# EAGLE design 0113-phobos (EAGLE 9.5.2)
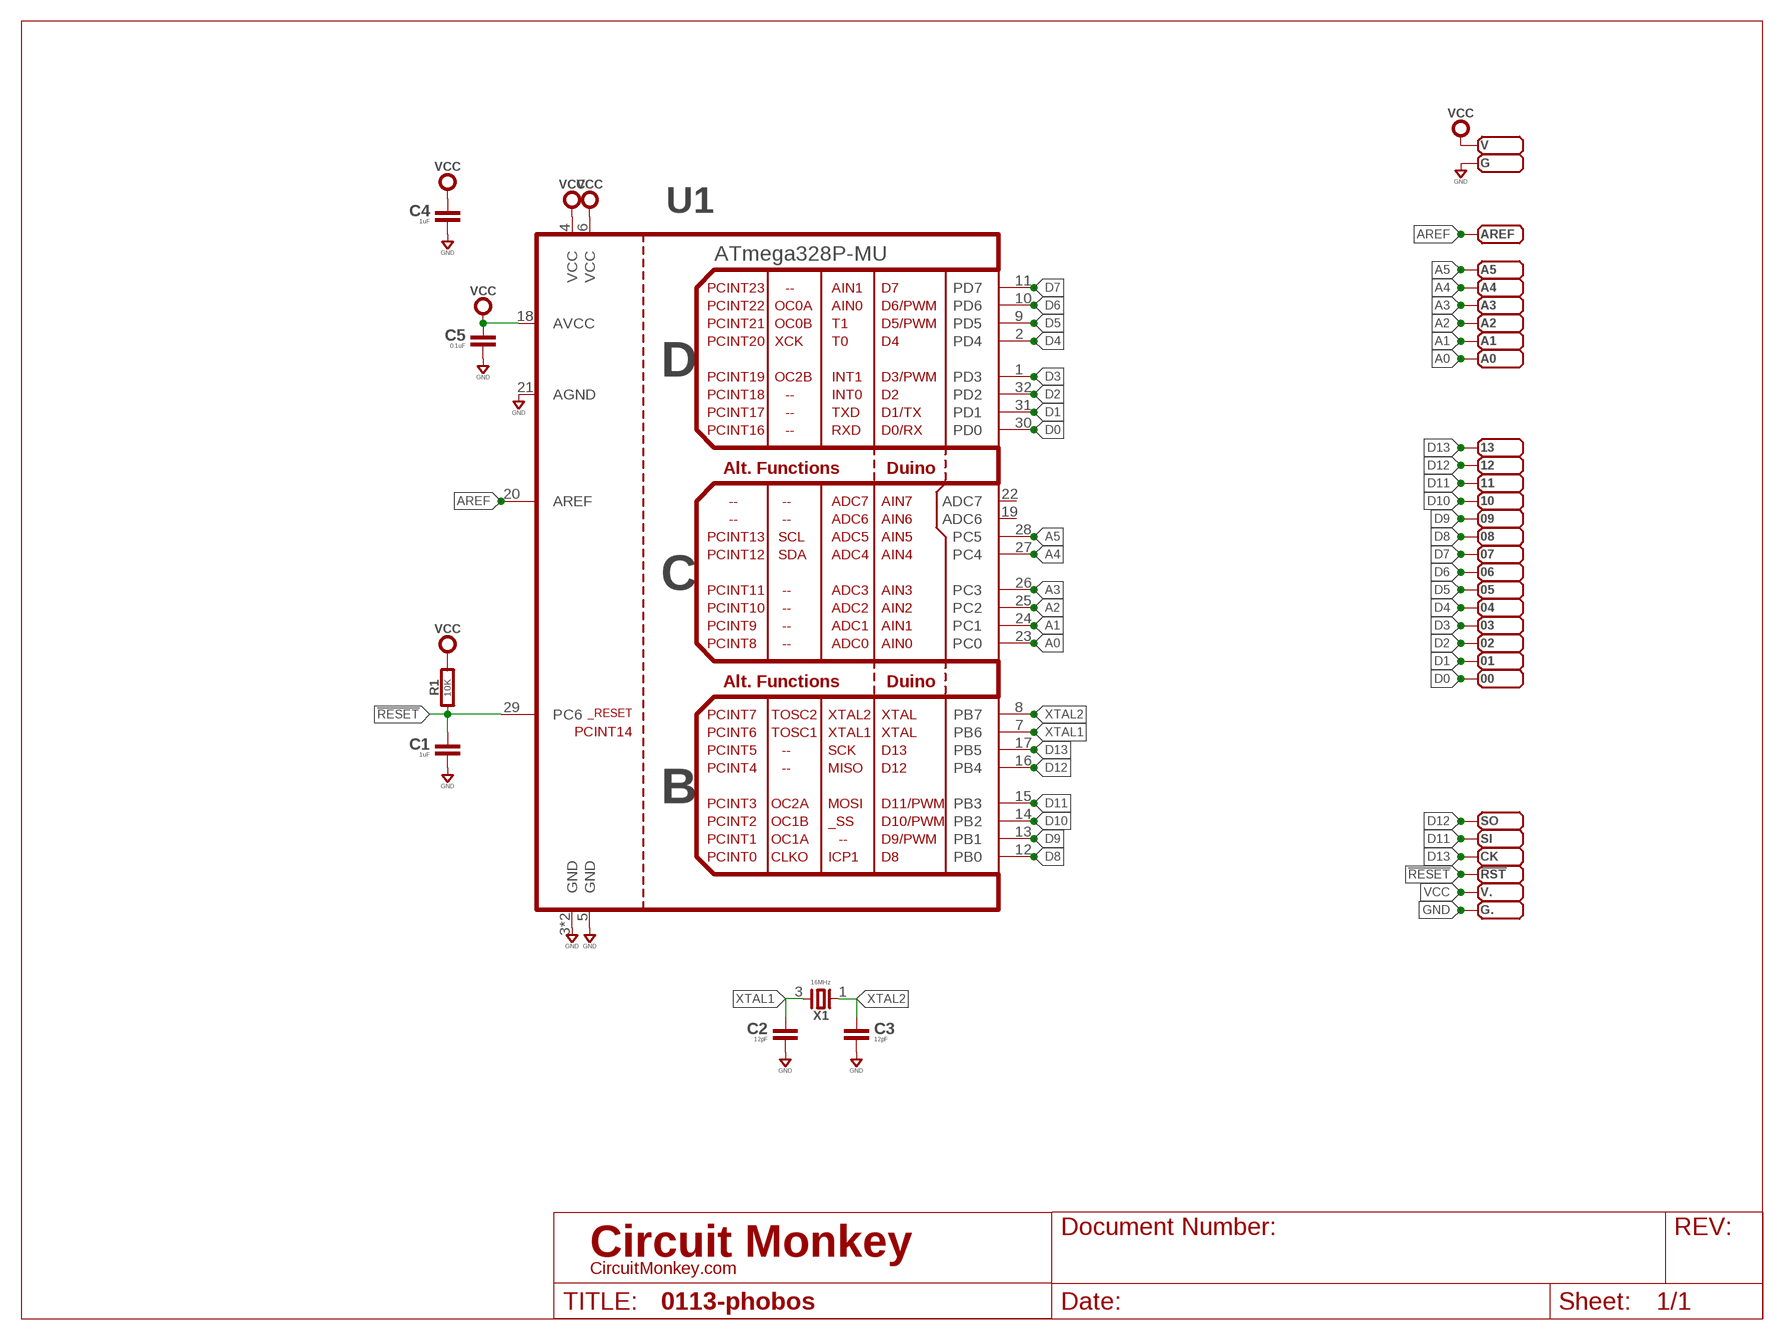
[diagram p0: schematic, sheet 1]

## Parts
00  PADSMD-070X070  [SMD-070MIL]
01  PADSMD-070X070  [SMD-070MIL]
02  PADSMD-070X070  [SMD-070MIL]
03  PADSMD-070X070  [SMD-070MIL]
04  PADSMD-070X070  [SMD-070MIL]
05  PADSMD-070X070  [SMD-070MIL]
06  PADSMD-070X070  [SMD-070MIL]
07  PADSMD-070X070  [SMD-070MIL]
08  PADSMD-070X070  [SMD-070MIL]
09  PADSMD-070X070  [SMD-070MIL]
10  PADSMD-070X070  [SMD-070MIL]
11  PADSMD-070X070  [SMD-070MIL]
12  PADSMD-070X070  [SMD-070MIL]
13  PADSMD-070X070  [SMD-070MIL]
!RST  PADSMD-070X070  [SMD-070MIL]
A0  PADSMD-070X070  [SMD-070MIL]
A1  PADSMD-070X070  [SMD-070MIL]
A2  PADSMD-070X070  [SMD-070MIL]
A3  PADSMD-070X070  [SMD-070MIL]
A4  PADSMD-070X070  [SMD-070MIL]
A5  PADSMD-070X070  [SMD-070MIL]
AREF  PADSMD-070X070  [SMD-070MIL]
C1  1uF  CAPACITOR0402  [0402-CAP]
C2  12pF  CAPACITOR0402  [0402-CAP]
C3  12pF  CAPACITOR0402  [0402-CAP]
C4  1uF  CAPACITOR0402  [0402-CAP]
C5  0.1uF  CAPACITOR0402  [0402-CAP]
CK  PADSMD-070X070  [SMD-070MIL]
G  PADSMD-070X070  [SMD-070MIL]
G.  PADSMD-070X070  [SMD-070MIL]
R1  10K  RESISTOR0402  [0402-RES]
SI  PADSMD-070X070  [SMD-070MIL]
SO  PADSMD-070X070  [SMD-070MIL]
U1  ATmega328P-MU  ATMEGA328MU  [MLF32]
V  PADSMD-070X070  [SMD-070MIL]
V.  PADSMD-070X070  [SMD-070MIL]
X1  16MHz  2P3.2X2.5  [32X25]

## Nets
!RESET: !RST.1(PAD) C1.1 R1.1 U1.29(PC6)
A0: A0.1(PAD) U1.23(PC0)
A1: A1.1(PAD) U1.24(PC1)
A2: A2.1(PAD) U1.25(PC2)
A3: A3.1(PAD) U1.26(PC3)
A4: A4.1(PAD) U1.27(PC4)
A5: A5.1(PAD) U1.28(PC5)
AREF: AREF.1(PAD) U1.20(AREF)
D0: 00.1(PAD) U1.30(PD0)
D1: 01.1(PAD) U1.31(PD1)
D2: 02.1(PAD) U1.32(PD2)
D3: 03.1(PAD) U1.1(PD3)
D4: 04.1(PAD) U1.2(PD4)
D5: 05.1(PAD) U1.9(PD5)
D6: 06.1(PAD) U1.10(PD6)
D7: 07.1(PAD) U1.11(PD7)
D8: 08.1(PAD) U1.12(PB0)
D9: 09.1(PAD) U1.13(PB1)
D10: 10.1(PAD) U1.14(PB2)
D11: 11.1(PAD) SI.1(PAD) U1.15(PB3)
D12: 12.1(PAD) SO.1(PAD) U1.16(PB4)
D13: 13.1(PAD) CK.1(PAD) U1.17(PB5)
GND: C1.2 C2.2 C3.2 C4.2 C5.2 G.1(PAD) G..1(PAD) U1.3(GND) U1.5(GND) U1.21(AGND) U1.PAD(GND)
VCC: C4.1 C5.1 R1.2 U1.4(VCC) U1.6(VCC) U1.18(AVCC) V.1(PAD) V..1(PAD)
XTAL1: C2.1 U1.7(PB6) X1.3
XTAL2: C3.1 U1.8(PB7) X1.1
Unconnected: U1.19(ADC6) U1.22(ADC7)

## Library data of the parts
00 01-09 10-13 !RST A0 A1-A5 AREF CK G G. SI SO V V. = con-testpoints:PAD: Solder Pad
C1-C5 = rlc:CAPACITOR: Capacitor CAP
R1 = rlc:RESISTOR: Resistor
U1 = atmel-atmega:ATMEGA328: Atmega 328P; MF: Atmel; MPN: atmega328p-mu; OC_MOUSER: 556-ATMEGA328P-MU; OC_SEEED: 310010005
X1 = xtal:2P: Crystal; MF: Epson; MPN: FA-238 16.0000MB-K3

## Board
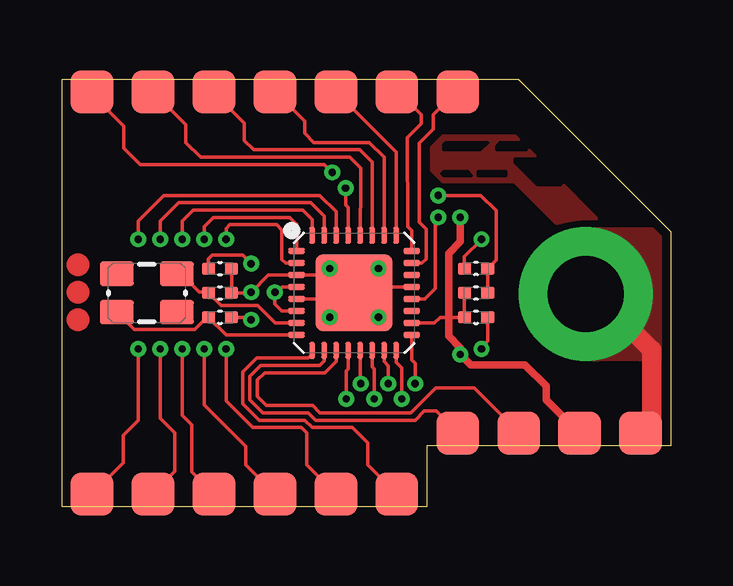
[diagram p1: board, top side]
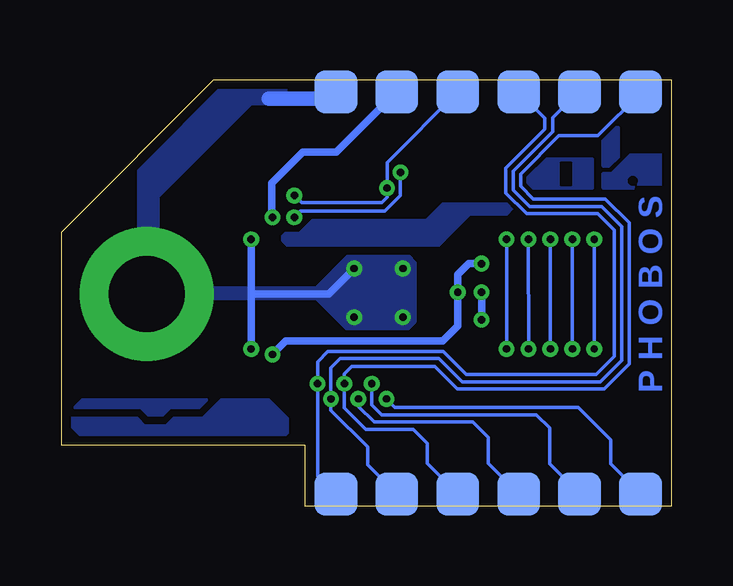
[diagram p2: board, bottom side, seen from below]

Size 25.4 x 17.78 mm. Coordinates in mm from the lower left corner, seen from the top.
Outline: 0,0 15.24,0 15.24,2.54 25.4,2.54 25.4,11.43 19.05,17.78 0,17.78 0,0
Copper layers (1*16): Top 0.0356mm / dielectric 1.5011mm / Bottom 0.0356mm
Design rules "OSH-CircuitMonkey *": minimum track width 6mil, minimum drill 12mil, track to track 6mil, track to pad 6mil, pad to pad 6mil, via to via 6mil, smd to smd 6mil, copper to edge 15mil, drill to drill 6mil, minimum pad ring 7mil, minimum via ring 7mil, stop-mask expansion 3mil, vias tented up to drill 12mil, thermal gap 10mil
tRestrict: area 15.9,14.9 to 17.8,15.2; area 18.9,13.4 to 20.8,14.5; area 15.8,13.8 to 17.1,13.9; area 17.4,13.8 to 18.5,13.9; area 18.1,14.9 to 19.4,15.2
bRestrict: area 1.4,13.4 to 1.8,13.8; area 4.2,13.4 to 4.6,14.3

### Footprints (pad centres in the part's own frame; a part is rotated, then mirrored left to right if it is on the bottom)
SMD-070MIL = smd 1.778 x 1.778: 1 0.508,0
0402-CAP = smd 0.559 x 0.508: 1 -0.483,0; 2 0.483,0
0402-RES = smd 0.559 x 0.508: 1 -0.483,0; 2 0.483,0
MLF32 = smd 0.7 x 0.25: 1 -2.4,1.75; 2 -2.4,1.25; 3 -2.4,0.75; 4 -2.4,0.25; 5 -2.4,-0.25; 6 -2.4,-0.75; 7 -2.4,-1.25; 8 -2.4,-1.75; 17 2.4,-1.75; 18 2.4,-1.25; 19 2.4,-0.75; 20 2.4,-0.25; 21 2.4,0.25; 22 2.4,0.75; 23 2.4,1.25; 24 2.4,1.75 | smd 0.25 x 0.7: 9 -1.75,-2.4; 10 -1.25,-2.4; 11 -0.75,-2.4; 12 -0.25,-2.4; 13 0.25,-2.4; 14 0.75,-2.4; 15 1.25,-2.4; 16 1.75,-2.4; 25 1.75,2.4; 26 1.25,2.4; 27 0.75,2.4; 28 0.25,2.4; 29 -0.25,2.4; 30 -0.75,2.4; 31 -1.25,2.4; 32 -1.75,2.4 | smd 3.2 x 3.2: PAD 0,0
32X25 = smd 1.4 x 1: 1 -1.25,-0.8; 2 1.25,-0.8; 3 1.25,0.8; 4 -1.25,0.8

### Placement (x,y rotation side)
00  1.27,0 90 top
01  3.81,0 90 top
02  6.35,0 90 top
03  8.89,0 90 top
04  11.43,0 90 top
05  13.97,0 90 top
06  16.51,2.54 90 top
07  19.05,2.54 90 top
08  1.27,0 90 bottom
09  3.81,0 90 bottom
10  6.35,0 90 bottom
11  8.89,0 90 bottom
12  11.43,0 90 bottom
13  13.97,0 90 bottom
!RST  8.89,17.78 270 bottom
A0  16.51,17.78 270 top
A1  13.97,17.78 270 top
A2  11.43,17.78 270 top
A3  8.89,17.78 270 top
A4  6.35,17.78 270 top
A5  3.81,17.78 270 top
AREF  1.27,17.78 270 top
C1  17.27,9.91 180 top
C2  6.6,8.89 0 top
C3  6.6,7.87 0 top
C4  6.6,9.91 0 top
C5  17.27,7.87 0 top
CK  6.35,17.78 270 bottom
G  24.13,2.54 90 top
G.  13.97,17.78 270 bottom
R1  17.27,8.89 180 top
SI  1.27,17.78 270 bottom
SO  3.81,17.78 270 bottom
U1  12.19,8.89 0 top
V  21.59,2.54 90 top
V.  11.43,17.78 270 bottom
X1  3.56,8.89 0 top

### Tracks (layer width: path | path; a pad name or v marks a point on that pad's centre or on a via)
!RESET  (via drill 0.3)
  Top 0.152: U1.29 11.94,12.45 11.84,12.55 v11.84,13.26 | R1.1 C1.1 18.11,10.26 18.11,12.32 17.48,12.95 v15.7,12.95
  Bottom 0.152: v15.7,12.95 15.39,12.65 12.06,12.65 11.84,12.88 v11.84,13.26 11.84,14.33 !RST.1
A0
  Top 0.152: U1.23 15.02,10.14 15.19,10.31 15.19,11.56 14.91,11.84 14.91,15.14 15.49,15.72 15.49,16.33 16.43,17.27 A0.1
A1
  Top 0.152: U1.24 14.59,11.49 14.43,11.66 14.4,15.37 14.99,15.95 14.99,16.33 14.05,17.27 A1.1
A2
  Top 0.152: U1.25 13.94,14.76 A2.1
A3
  Top 0.152: U1.26 13.44,14.55 12.83,15.16 10.52,15.16 10.13,15.54 10.13,16.05 8.91,17.27 A3.1
A4
  Top 0.152: U1.27 12.94,14.34 12.42,14.86 8,14.86 7.62,15.24 7.62,15.98 6.35,17.25 A4.1
A5
  Top 0.152: U1.28 12.44,12.41 12.47,12.44 12.47,14.1 12.02,14.55 5.79,14.55 5.18,15.16 5.18,15.9 A5.1
AAA
  pour Bottom: 24.99,3.35 24.99,3.66 22.25,3.66 21.95,3.35 21.03,3.35 20.73,3.66 19.51,3.66 18.75,4.42 16.76,4.42 16,3.66 16,3.05 16.15,2.9 24.54,2.9
AREF  (via drill 0.3)
  Top 0.152: U1.20 15.14,8.64 15.57,9.07 15.57,11.91 v15.7,12.04 | v11.28,13.92 10.95,14.25 3.28,14.25 2.59,14.94 2.59,15.85 1.27,17.17 AREF.1
  Bottom 0.152: v15.7,12.04 15.44,12.29 11.94,12.29 11.28,12.96 v11.28,13.92
BBB
  pour Bottom: 19.66,4.11 19.35,4.42 24.54,4.42 24.84,4.11 22.1,4.11 21.79,3.81 21.18,3.81 20.88,4.11
CCC
  pour Bottom: 5.74,13.26 5.94,13.46 5.94,13.72 5.18,14.48 3.28,14.48 3.28,13.26
D0  (via drill 0.3)
  Top 0.152: v3.2,6.55 3.2,3.58 2.56,2.95 2.56,1.8 00.1 | U1.30 11.44,12.28 10.77,12.95 4.27,12.95 3.2,11.89 v3.2,11.12
  Bottom 0.152: v3.2,11.12 v3.2,6.55
D1  (via drill 0.3)
  Top 0.152: U1.31 10.94,12.09 10.38,12.65 4.88,12.65 4.12,11.89 v4.12,11.12 | 01.1 4.12,0.81 4.12,0.84 4.72,1.45 4.72,3.05 4.12,3.66 v4.12,6.55
  Bottom 0.152: v4.12,11.12 v4.12,6.55
D2  (via drill 0.3)
  Top 0.152: U1.32 10.44,11.95 10.05,12.34 5.49,12.34 5.03,11.89 v5.03,11.12 | v5.03,6.55 5.03,3.79 5.44,3.38 5.44,1.42 02.1
  Bottom 0.152: v5.03,11.12 v5.03,6.55
D3  (via drill 0.3)
  Top 0.152: U1.1 9.79,11.75 9.5,12.04 6.33,12.04 5.94,11.65 v5.94,11.12 | v5.94,6.55 5.94,4.22 7.67,2.49 7.67,1.73 03.1
  Bottom 0.152: v5.94,6.55 5.93,6.56 v5.94,11.12
D4  (via drill 0.3)
  Top 0.152: U1.2 9.34,10.14 9.18,10.29 9.18,11.51 8.96,11.73 7.01,11.73 6.86,11.58 v6.86,11.12 | v6.86,6.55 6.86,4.39 7.98,3.28 9.98,3.28 10.21,3.05 10.21,1.73 04.1
  Bottom 0.152: v6.86,11.12 v6.85,6.56 v6.86,6.55
D5
  Top 0.152: U1.9 10.44,6.34 10.29,6.18 8.13,6.18 7.54,5.6 7.54,4.27 8.23,3.58 10.13,3.58 10.44,3.28 12.12,3.28 12.75,2.64 12.75,1.73 05.1
D6
  Top 0.152: U1.10 10.95,6.06 10.76,5.87 8.31,5.87 7.85,5.41 7.85,4.42 8.38,3.89 10.29,3.89 10.59,3.58 14.73,3.58 15.11,3.96 15.62,3.96 16.51,3.07 06.1
D7
  Top 0.152: U1.11 11.44,6.04 11.3,5.9 10.97,5.56 8.46,5.56 8.15,5.26 8.15,4.57 8.53,4.19 10.46,4.19 10.77,3.89 14.55,3.89 15.6,4.93 17.2,4.93 19.05,3.07 07.1
D8  (via drill 0.3)
  Top 0.152: U1.12 11.94,5.72 11.86,5.64 v11.86,4.47
  Bottom 0.152: 08.1 2.52,1.75 2.52,2.77 3.86,4.12 11.51,4.12 v11.86,4.47
D9  (via drill 0.3)
  Top 0.152: v12.47,5.11 12.44,5.13 U1.13
  Bottom 0.152: 09.1 5.05,1.75 5.05,3.25 5.61,3.81 12.06,3.81 12.47,4.22 v12.47,5.11
D10  (via drill 0.3)
  Top 0.152: U1.14 12.94,5.8 13.03,5.72 v13.03,4.47
  Bottom 0.152: 10.1 7.62,1.78 7.62,2.87 8.26,3.5 12.37,3.5 13.03,4.17 v13.03,4.47
D11  (via drill 0.3)
  Top 0.152: U1.15 13.44,6.03 13.61,5.85 v13.61,5.11
  Bottom 0.152: 11.1 10.16,1.78 10.16,2.62 10.74,3.2 12.72,3.2 13.61,4.09 v13.61,5.11 13.61,5.51 13.31,5.82 9.85,5.82 8.91,4.88 2.79,4.88 1.75,5.92 1.75,11.81 2.74,12.8 5.74,12.8 6.27,13.34 6.27,13.84 4.67,15.44 3.05,15.44 1.27,17.22 SI.1
D12  (via drill 0.3)
  Top 0.152: U1.16 13.95,5.99 14.17,5.77 v14.17,4.47
  Bottom 0.152: 12.1 12.65,1.73 12.65,2.46 14.17,3.99 v14.17,4.47 14.17,5.77 13.79,6.15 9.68,6.15 8.71,5.18 2.95,5.18 2.06,6.07 2.06,11.66 2.9,12.5 5.89,12.5 6.58,13.18 6.58,13.97 4.93,15.62 4.93,16.2 3.86,17.27 SO.1
D13  (via drill 0.3)
  Top 0.152: U1.17 14.59,6.1 14.73,5.96 v14.73,5.11
  Bottom 0.152: 13.1 13.99,0.51 14.73,1.25 v14.73,5.11 14.73,6.02 14.3,6.45 9.5,6.45 8.53,5.49 3.12,5.49 2.36,6.25 2.36,11.51 3.05,12.19 6.02,12.19 6.88,13.06 6.88,14.1 5.26,15.72 5.26,16.18 CK.1
DDD
  pour Bottom: 2.82,13.26 2.82,13.87 2.46,13.87 1.7,14.63 0.15,14.63 0.15,13.26
EEE
  pour Bottom: 2.21,14.55 2.59,14.17 2.82,14.17 2.82,15.24 2.29,15.77 2.21,15.77
FFF
  pour Top: 20.61,11.78 arc-20 22.31,11.99 18.9,15.43 15.89,15.43 15.43,14.97 15.43,13.98 15.89,13.53 18.86,13.53
GGG
  pour Bottom: 8.38,12.12 9.68,10.82 16,10.82 16.23,11.05 16.23,11.28 16.08,11.43 15.47,11.43 14.94,11.96 10.21,11.96 9.53,12.65 6.86,12.65 6.59,12.38 6.86,12.12
GND  (via drill 0.3, 3.17 pad 5.59)
  Top 0.152: C4.2 C2.2 7.59,8.89 7.62,8.91 v7.9,8.91 8.62,9.64 U1.3 10.91,9.64 11.07,9.8 | 11.07,9.8 v11.18,9.91 | U1.5 10.87,8.64 11.18,8.33 v11.18,7.87 | U1.21 13.47,9.14 13.21,9.4 v13.21,9.91 U1.PAD | C3.2 7.8,7.87 v7.9,7.77 | C1.2 16.79,10.41 v17.5,11.12 | v17.5,6.55 17.5,6.63 17.75,6.88 C5.2 | U1.PAD 11.28,9.8 11.07,9.8 | U1.PAD v13.21,7.87 | G.1 23.88,3.3
  Top 0.813: G.1 24.59,3.5 24.59,6.5 22.25,8.84 v21.84,8.84
  Bottom 0.305: v7.9,8.91 v7.9,7.77 | 17.5,8.84 v17.5,6.55 | 17.5,8.84 14.28,8.84 v13.21,9.91 | v17.5,11.12 17.5,8.84
  Bottom 0.61: G..1 14.25,16.99 16.76,16.99
  pour Bottom: 10.62,10.16 10.9,10.44 13.51,10.44 14.81,9.14 20.42,9.14 21.34,10.06 21.34,12.88 17.48,16.74 16,16.74 16,17.6 18.67,17.6 22.25,14.02 22.25,8.61 14.81,8.61 13.56,7.37 10.92,7.37 10.62,7.67
  pour Top: 21.82,11.61 25.22,11.61 25.4,11.43 25.4,6.05 21.82,6.05
  pour Bottom: 20.88,14.1 20.88,13.79 21.18,13.79 21.49,14.1 21.49,14.33 21.41,14.4 21.18,14.4
  pour Bottom: 18.06,17.14 18.97,17.14 19.2,16.92 19.2,16.61 18.59,16 18.36,16 17.98,16.38 17.98,16.92 17.98,17.07
VCC  (via drill 0.3)
  Top 0.152: v7.9,10.11 7.54,10.46 6.27,10.46 6.12,10.31 C4.1 | U1.6 9.18,8.14 8.89,8.43 v8.89,8.91 8.97,8.91 9.19,9.14 U1.4 | U1.18 15.54,7.64 15.77,7.87 16.13,7.87 C5.1 R1.2
  Top 0.305: V.1 21.57,3.05 20.19,4.42 20.19,5 19.3,5.89 17.04,5.89 v16.61,6.33 16.61,6.6 16.13,7.09 16.13,7.87 16.13,10.54 16.61,11.02 v16.61,12.04
  Bottom 0.305: v7.9,10.11 8.44,10.11 8.89,9.66 v8.89,8.91 8.89,7.52 9.53,6.88 16.05,6.88 v16.61,6.33 | v16.61,12.04 16.64,12.06 16.64,13.46 15.34,14.76 13.95,14.76 V..1
XTAL1
  Top 0.152: U1.7 8.9,7.64 8.18,8.36 6.66,8.36 C2.1 6.08,8.93 5.75,8.93 4.98,9.69 X1.3
XTAL2
  Top 0.152: U1.8 7.85,7.14 6.86,7.14 C3.1 6.05,7.87 5.54,7.36 3.04,7.36 X1.1
(copper drawn outside any net)
  shapes: Top circle x3

### Text on the board
Bottom: P H O B O S
tStop: REF | 5 | 4 | 3 | 2 | 1 | 0 | ANALOG
bStop: P H O B O S
bRestrict: 0113A